# Altium schematic sheet FMC_LOOPBACK.SchDoc: Connector (LPC rows)
size A4; Date: 20.10.2018; DrawnBy: PFH; Engineer: PFH; DocumentNumber: 1; Revision: A; SheetNumber: 1; SheetTotal: 2; Projekt: FMC Loopback; Website: www.fmchub.com; ProjectName: FMC_Loopback
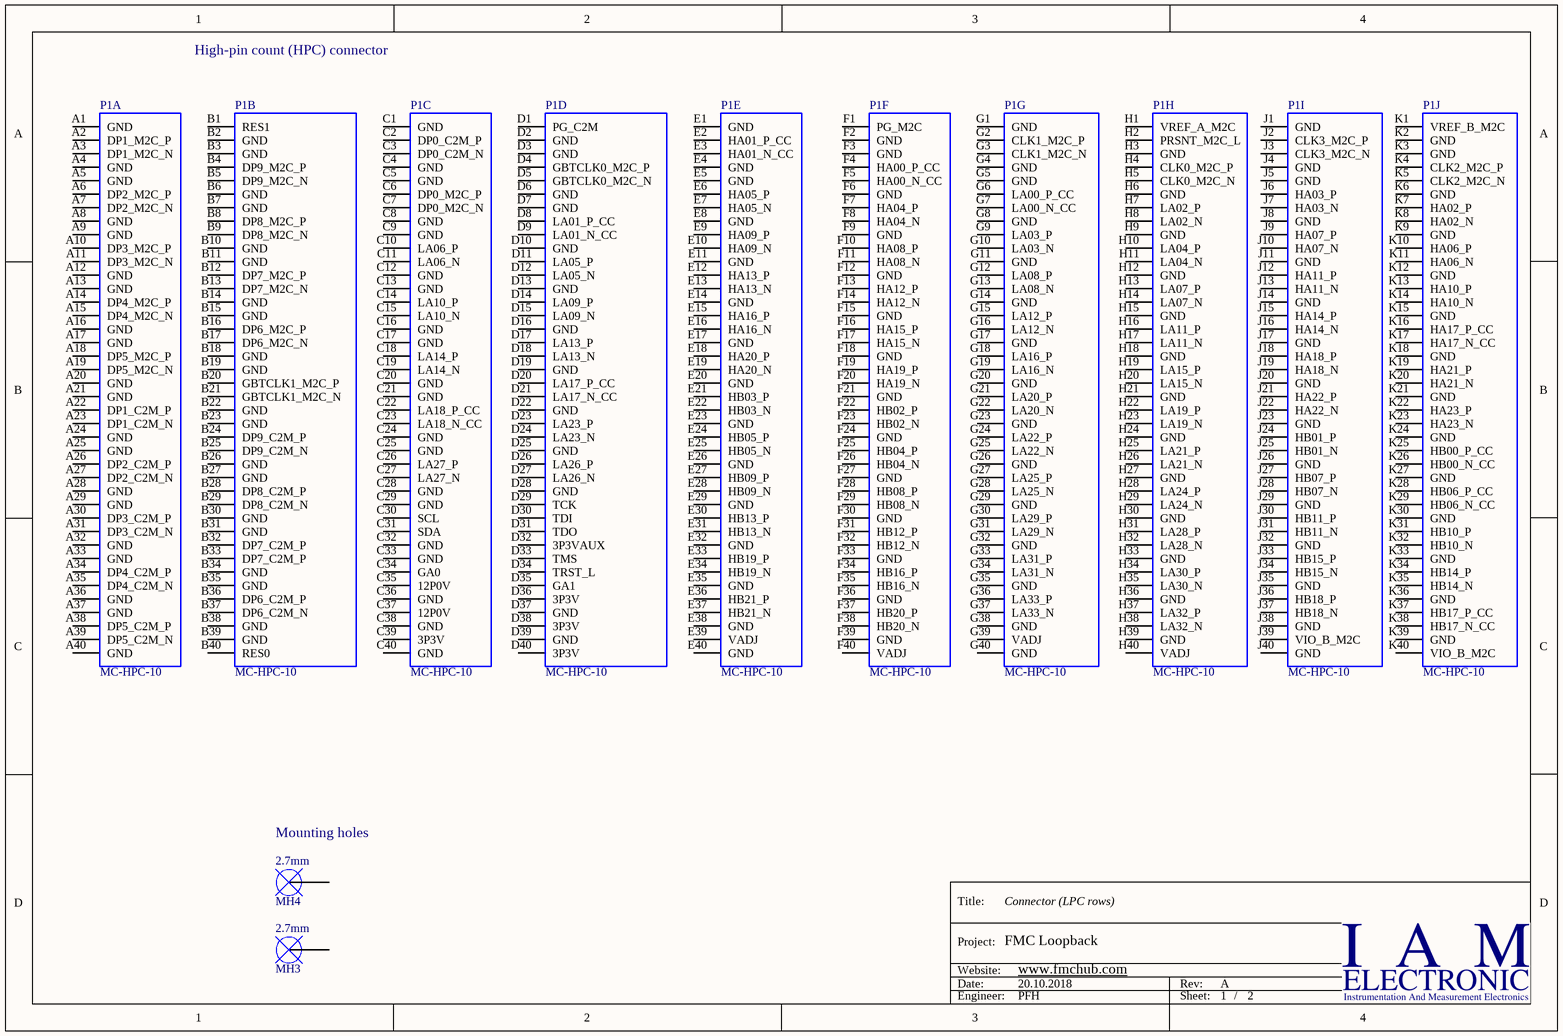
[diagram p0: FMC_LOOPBACK.SchDoc]

## Parts
MH3  2.7mm  [Mounting_Hole_Plated_2.7mm-COVERED]  (no BOM)
MH4  2.7mm  [Mounting_Hole_Plated_2.7mm-COVERED]  (no BOM)
P1  MC-HPC-10  [ASP-134488-01]  (parts A,B,C,D,E,F,G,H,I,J of 10)

## Nets

Not connected (* = marked no-connect by the designer): MH3 0; MH4 0; P1 A1(GND) A2(DP1_M2C_P) A3(DP1_M2C_N) A4(GND) A5(GND) A6(DP2_M2C_P) A7(DP2_M2C_N) A8(GND) A9(GND) A10(DP3_M2C_P) A11(DP3_M2C_N) A12(GND) A13(GND) A14(DP4_M2C_P) A15(DP4_M2C_N) A16(GND) A17(GND) A18(DP5_M2C_P) A19(DP5_M2C_N) A20(GND) A21(GND) A22(DP1_C2M_P) A23(DP1_C2M_N) A24(GND) A25(GND) A26(DP2_C2M_P) A27(DP2_C2M_N) A28(GND) A29(GND) A30(DP3_C2M_P) A31(DP3_C2M_N) A32(GND) A33(GND) A34(DP4_C2M_P) A35(DP4_C2M_N) A36(GND) A37(GND) A38(DP5_C2M_P) A39(DP5_C2M_N) A40(GND) B1(RES1) B2(GND) B3(GND) B4(DP9_M2C_P) B5(DP9_M2C_N) B6(GND) B7(GND) B8(DP8_M2C_P) B9(DP8_M2C_N) B10(GND) B11(GND) B12(DP7_M2C_P) B13(DP7_M2C_N) B14(GND) B15(GND) B16(DP6_M2C_P) B17(DP6_M2C_N) B18(GND) B19(GND) B20(GBTCLK1_M2C_P) B21(GBTCLK1_M2C_N) B22(GND) B23(GND) B24(DP9_C2M_P) B25(DP9_C2M_N) B26(GND) B27(GND) B28(DP8_C2M_P) B29(DP8_C2M_N) B30(GND) B31(GND) B32(DP7_C2M_P) B33(DP7_C2M_P) B34(GND) B35(GND) B36(DP6_C2M_P) B37(DP6_C2M_N) B38(GND) B39(GND) B40(RES0) C1(GND) C2(DP0_C2M_P) C3(DP0_C2M_N) C4(GND) C5(GND) C6(DP0_M2C_P) C7(DP0_M2C_N) C8(GND) C9(GND) C10(LA06_P) C11(LA06_N) C12(GND) C13(GND) C14(LA10_P) C15(LA10_N) C16(GND) C17(GND) C18(LA14_P) C19(LA14_N) C20(GND) C21(GND) C22(LA18_P_CC) C23(LA18_N_CC) C24(GND) C25(GND) C26(LA27_P) C27(LA27_N) C28(GND) C29(GND) C30(SCL) C31(SDA) C32(GND) C33(GND) C34(GA0) C35(12P0V) C36(GND) C37(12P0V) C38(GND) C39(3P3V) C40(GND) D1(PG_C2M) D2(GND) D3(GND) D4(GBTCLK0_M2C_P) D5(GBTCLK0_M2C_N) D6(GND) D7(GND) D8(LA01_P_CC) D9(LA01_N_CC) D10(GND) D11(LA05_P) D12(LA05_N) D13(GND) D14(LA09_P) D15(LA09_N) D16(GND) D17(LA13_P) D18(LA13_N) D19(GND) D20(LA17_P_CC) D21(LA17_N_CC) D22(GND) D23(LA23_P) D24(LA23_N) D25(GND) D26(LA26_P) D27(LA26_N) D28(GND) D29(TCK) D30(TDI) D31(TDO) D32(3P3VAUX) D33(TMS) D34(TRST_L) D35(GA1) D36(3P3V) D37(GND) D38(3P3V) D39(GND) D40(3P3V) E1(GND) E2(HA01_P_CC) E3(HA01_N_CC) E4(GND) E5(GND) E6(HA05_P) E7(HA05_N) E8(GND) E9(HA09_P) E10(HA09_N) E11(GND) E12(HA13_P) E13(HA13_N) E14(GND) E15(HA16_P) E16(HA16_N) E17(GND) E18(HA20_P) E19(HA20_N) E20(GND) E21(HB03_P) E22(HB03_N) E23(GND) E24(HB05_P) E25(HB05_N) E26(GND) E27(HB09_P) E28(HB09_N) E29(GND) E30(HB13_P) E31(HB13_N) E32(GND) E33(HB19_P) E34(HB19_N) E35(GND) E36(HB21_P) E37(HB21_N) E38(GND) E39(VADJ) E40(GND) F1(PG_M2C) F2(GND) F3(GND) F4(HA00_P_CC) F5(HA00_N_CC) F6(GND) F7(HA04_P) F8(HA04_N) F9(GND) F10(HA08_P) F11(HA08_N) F12(GND) F13(HA12_P) F14(HA12_N) F15(GND) F16(HA15_P) F17(HA15_N) F18(GND) F19(HA19_P) F20(HA19_N) F21(GND) F22(HB02_P) F23(HB02_N) F24(GND) F25(HB04_P) F26(HB04_N) F27(GND) F28(HB08_P) F29(HB08_N) F30(GND) F31(HB12_P) F32(HB12_N) F33(GND) F34(HB16_P) F35(HB16_N) F36(GND) F37(HB20_P) F38(HB20_N) F39(GND) F40(VADJ) G1(GND) G2(CLK1_M2C_P) G3(CLK1_M2C_N) G4(GND) G5(GND) G6(LA00_P_CC) G7(LA00_N_CC) G8(GND) G9(LA03_P) G10(LA03_N) G11(GND) G12(LA08_P) G13(LA08_N) G14(GND) G15(LA12_P) G16(LA12_N) G17(GND) G18(LA16_P) G19(LA16_N) G20(GND) G21(LA20_P) G22(LA20_N) G23(GND) G24(LA22_P) G25(LA22_N) G26(GND) G27(LA25_P) G28(LA25_N) G29(GND) G30(LA29_P) G31(LA29_N) G32(GND) G33(LA31_P) G34(LA31_N) G35(GND) G36(LA33_P) G37(LA33_N) G38(GND) G39(VADJ) G40(GND) H1(VREF_A_M2C) H2(PRSNT_M2C_L) H3(GND) H4(CLK0_M2C_P) H5(CLK0_M2C_N) H6(GND) H7(LA02_P) H8(LA02_N) H9(GND) H10(LA04_P) H11(LA04_N) H12(GND) H13(LA07_P) H14(LA07_N) H15(GND) H16(LA11_P) H17(LA11_N) H18(GND) H19(LA15_P) H20(LA15_N) H21(GND) H22(LA19_P) H23(LA19_N) H24(GND) H25(LA21_P) H26(LA21_N) H27(GND) H28(LA24_P) H29(LA24_N) H30(GND) H31(LA28_P) H32(LA28_N) H33(GND) H34(LA30_P) H35(LA30_N) H36(GND) H37(LA32_P) H38(LA32_N) H39(GND) H40(VADJ) J1(GND) J2(CLK3_M2C_P) J3(CLK3_M2C_N) J4(GND) J5(GND) J6(HA03_P) J7(HA03_N) J8(GND) J9(HA07_P) J10(HA07_N) J11(GND) J12(HA11_P) J13(HA11_N) J14(GND) J15(HA14_P) J16(HA14_N) J17(GND) J18(HA18_P) J19(HA18_N) J20(GND) J21(HA22_P) J22(HA22_N) J23(GND) J24(HB01_P) J25(HB01_N) J26(GND) J27(HB07_P) J28(HB07_N) J29(GND) J30(HB11_P) J31(HB11_N) J32(GND) J33(HB15_P) J34(HB15_N) J35(GND) J36(HB18_P) J37(HB18_N) J38(GND) J39(VIO_B_M2C) J40(GND) K1(VREF_B_M2C) K2(GND) K3(GND) K4(CLK2_M2C_P) K5(CLK2_M2C_N) K6(GND) K7(HA02_P) K8(HA02_N) K9(GND) K10(HA06_P) K11(HA06_N) K12(GND) K13(HA10_P) K14(HA10_N) K15(GND) K16(HA17_P_CC) K17(HA17_N_CC) K18(GND) K19(HA21_P) K20(HA21_N) K21(GND) K22(HA23_P) K23(HA23_N) K24(GND) K25(HB00_P_CC) K26(HB00_N_CC) K27(GND) K28(HB06_P_CC) K29(HB06_N_CC) K30(GND) K31(HB10_P) K32(HB10_N) K33(GND) K34(HB14_P) K35(HB14_N) K36(GND) K37(HB17_P_CC) K38(HB17_N_CC) K39(GND) K40(VIO_B_M2C)

## Notes on the sheet
- High-pin count (HPC) connector
- (near MH4) Mounting holes
- Title:
- Project:
- Date:
- Website:
- Rev:
- Engineer:
- Sheet:
- /

## Library data of the parts
MH3 MH4 = Mounting_Hole_2.7mm: Mounting hole, hole size 2.7mm; Hole radius: 2.7 mm; Diameter (plated): *; Keep out (radius): *; Plated: *
P1 = MC-HPC-10: MC-HPC-10, FMC High-pin count connector, lead free, 400 I/Os, male, 10 mm mated stack height; Manufacturer: Samtec; Manufacturer Ref: SEAM-40-03.5-S-10-2-A-K-TR-VITA57.0; Pitch: 1.27 mm; Mated Stack Height: 10 mm; Solder Type: Lead-Free; Number I/O: 400; PartName: ASP-134488-01; Part: ASP-134488-01; Vita PartNumber: MC-HPC-10; Pin Count: High; Gender: male; Supplier 1: Digi-Key; Supplier Part Number 1: SAM8730-ND